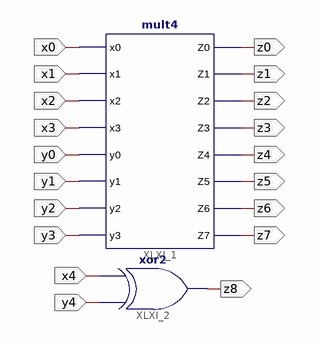
[diagram p0: schematic sheet 1]
// Xilinx ISE schematic multiplicador_4bs.sch (spartan6) as structural Verilog: 2 symbols, 19 ports
module multiplicador_4bs (
  input  x0,
  input  x1,
  input  x2,
  input  x3,
  input  y0,
  input  y1,
  input  y2,
  input  y3,
  input  x4,
  input  y4,
  output z8,
  output z7,
  output z6,
  output z5,
  output z4,
  output z3,
  output z2,
  output z1,
  output z0
);

  mult4 XLXI_1 (
    .x0(x0), .x1(x1), .x2(x2), .x3(x3), .y0(y0), .y1(y1), .y2(y2), .y3(y3), .Z0(z0), .Z1(z1), .Z2(z2),
    .Z3(z3), .Z4(z4), .Z5(z5), .Z6(z6), .Z7(z7));
  xor XLXI_2 (z8, y4, x4);
endmodule
